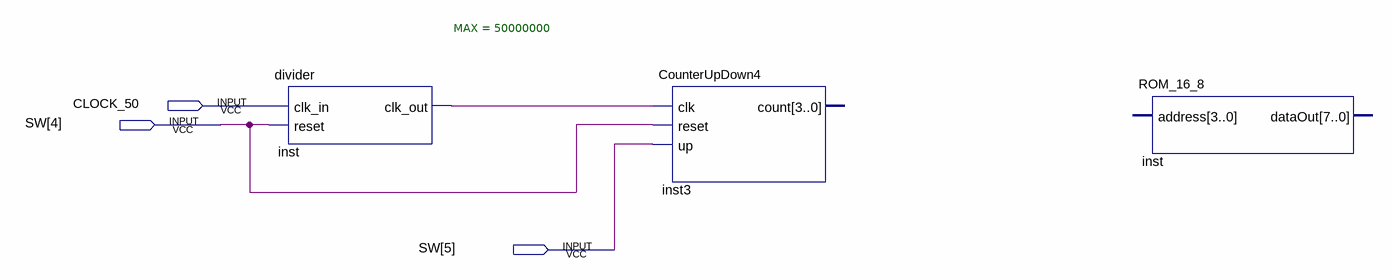
[diagram p0: schematic sheet]
// Quartus schematic ROM_Demo.bdf as structural Verilog: 3 symbols, 3 pins
module ROM_Demo (
  input  CLOCK_50,
  input  [5:4] SW
);

  wire inst_clk_out;

  divider #(.MAX(50000000)) inst (.clk_in(CLOCK_50), .reset(SW[4]), .clk_out(inst_clk_out));
  CounterUpDown4 inst3 (.clk(inst_clk_out), .reset(SW[4]), .up(SW[5]));  // open: count
  ROM_16_8 inst_dup2 ();  // open: address, dataOut
endmodule
